# EAGLE design Grove_RTD_Sensor (EAGLE 6.5.0)
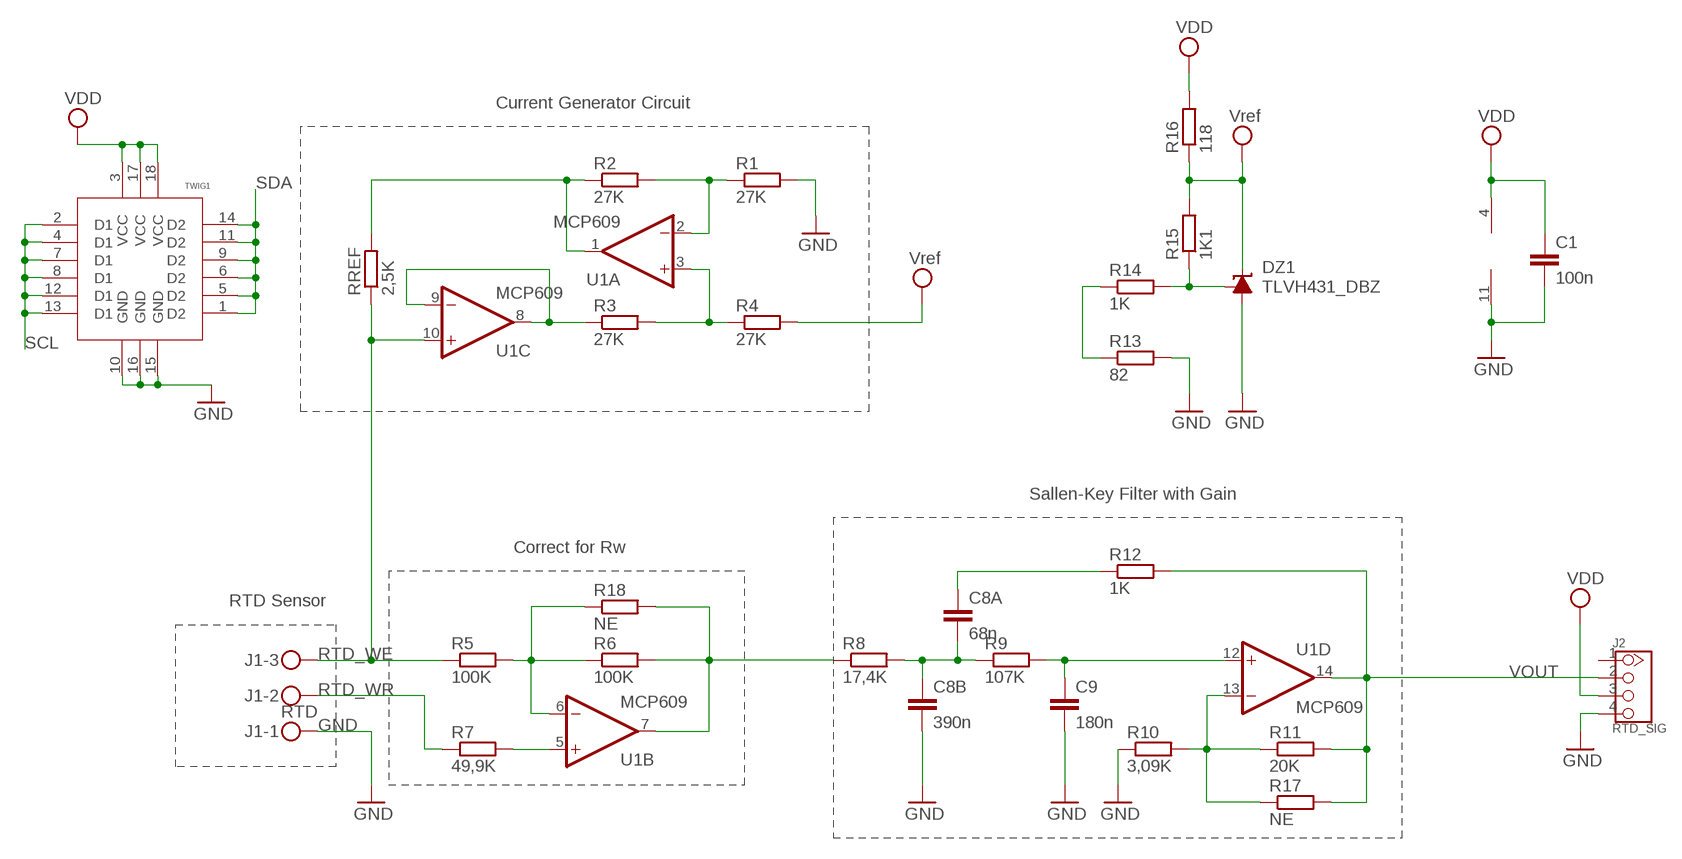
[diagram p0: schematic, sheet 1]

## Parts
C1  100n  C-EUC0805  [C0805]
C8A  68n  C-EUC0805  [C0805]
C8B  390n  C-EUC0805  [C0805]
C9  180n  C-EUC0805  [C0805]
DZ1  TLVH431_DBZ  [SOT23]
J1  RTD  MKDSN1,5/3-5,08  [MKDSN1,5/3-5,08]
J2  RTD_SIG  TWIG_2.0-DIP-FEMALE  [2.0_1X4]
R1  27K  R-EU_R0805  [R0805]
R2  27K  R-EU_R0805  [R0805]
R3  27K  R-EU_R0805  [R0805]
R4  27K  R-EU_R0805  [R0805]
R5  100K  R-EU_R0805  [R0805]
R6  100K  R-EU_R0805  [R0805]
R7  49,9K  R-EU_R0805  [R0805]
R8  17,4K  R-EU_R0805  [R0805]
R9  107K  R-EU_R0805  [R0805]
R10  3,09K  R-EU_R0805  [R0805]
R11  20K  R-EU_R0805  [R0805]
R12  1K  R-EU_R0805  [R0805]
R13  82  R-EU_R0805  [R0805]
R14  1K  R-EU_R0805  [R0805]
R15  1K1  R-EU_R0805  [R0805]
R16  118  R-EU_R0805  [R0805]
R17  NE  R-EU_R0805  [R0805]
R18  NE  R-EU_R0805  [R0805]
RREF  2,5K  R-EU_R0805  [R0805]
TWIG1  TWIG-U2'HOLES'  [U2_HOLES]
U1  MCP609  [SO14]

## Nets
GND: C1.2 C8B.2 C9.2 DZ1.3(A) J1.1 J2.4 R1.2 R10.1 R13.2 TWIG1.10(GND) TWIG1.15(GND) TWIG1.16(GND) U1.11(P:V-)
N$1: R1.1 R2.2 U1.2(A:-IN)
N$2: R3.2 R4.1 U1.3(A:+IN)
N$3: R2.1 RREF.2 U1.1(A:OUT)
N$4: R3.1 U1.8(C:OUT) U1.9(C:-IN)
N$5: DZ1.1(FB) R14.2 R15.1
N$6: R6.2 R8.1 R18.2 U1.7(B:OUT)
N$7: R7.2 U1.5(B:+IN)
N$8: R5.2 R6.1 R18.1 U1.6(B:-IN)
N$9: R13.1 R14.1
N$10: C9.1 R9.2 U1.12(D:+IN)
N$11: C8A.2 C8B.1 R8.2 R9.1
N$13: R10.2 R11.1 R17.1 U1.13(D:-IN)
N$15: C8A.1 R12.1
RTD_WE: J1.3 R5.1 RREF.1 U1.10(C:+IN)
RTD_WR: J1.2 R7.1
SCL: TWIG1.2(D1) TWIG1.4(D1) TWIG1.7(D1) TWIG1.8(D1) TWIG1.12(D1) TWIG1.13(D1)
SDA: TWIG1.1(D2) TWIG1.5(D2) TWIG1.6(D2) TWIG1.9(D2) TWIG1.11(D2) TWIG1.14(D2)
VDD: C1.1 J2.3 R16.2 TWIG1.3(VCC) TWIG1.17(VCC) TWIG1.18(VCC) U1.4(P:V+)
VEE: DZ1.2(C) R4.2 R15.2 R16.1 ; supply symbol labelled Vref
VOUT: J2.2 R11.2 R12.2 R17.2 U1.14(D:OUT)
Unconnected: J2.1

## Notes on the sheet
- Current Generator Circuit
- Sallen-Key Filter with Gain
- Correct for Rw
- RTD Sensor

## Library data of the parts
C1 C8A C8B C9 = rcl:C-EU: CAPACITOR, European symbol
DZ1 = PRECISION VOLTAGE REFERENCE:TLVH431_: TEXAS Instruments TLVH431 LOW-VOLTAGE ADJUSTABLE PRECISION SHUNT REGULATOR Features: low-voltage operation ... down to 1.24V reference voltage tolerances at 25°C - 0.5% for B grade - 1% for A grade - 1.5% for standard grade adjustable output voltage, Vo = Vref to 18V wide operating cathode current range ... 55 µA to 80 mA 0.25 hom typycal output impedance -40°C to 125°C specifications TLVH432 provides alternative pinouts for SOT-23-3 and SOT-89 packages ultra-small SC-70 package offers 40% smaller footprint than SOT-23-3
J1 = con-phoenix-508:MKDSN1,5/3-5,08: MKDSN 1,5/ 3-5,08 Printklemme Nennstrom: 13,5 A Nennspannung: 250 V Rastermaß: 5,08 mm Polzahl: 3 Anschlussart: Schraubanschluss Montage: Löten Anschlussrichtung Leiter/Platine: 0 ° Artikelnummer: 1729131 Source: http://eshop.phoenixcontact.com .. 1729131.pdf
J2 = Connector:TWIG_2.0-DIP-FEMALE
R1-R18 RREF = rcl:R-EU_: RESISTOR, European symbol
TWIG1 = EXT_moudle:TWIG-U2
U1 = MICROCHIP:MCP609: Quad Op Amp 2.5V to 5.5V Single Supply CMOS

## Board
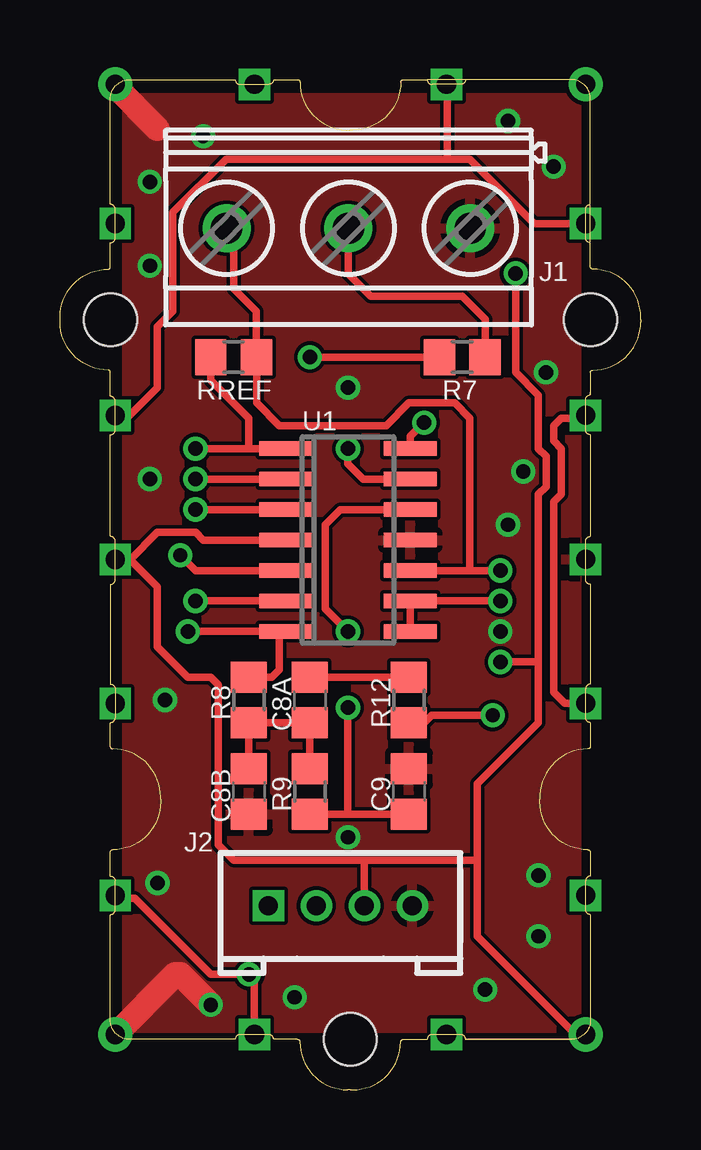
[diagram p1: board, top side]
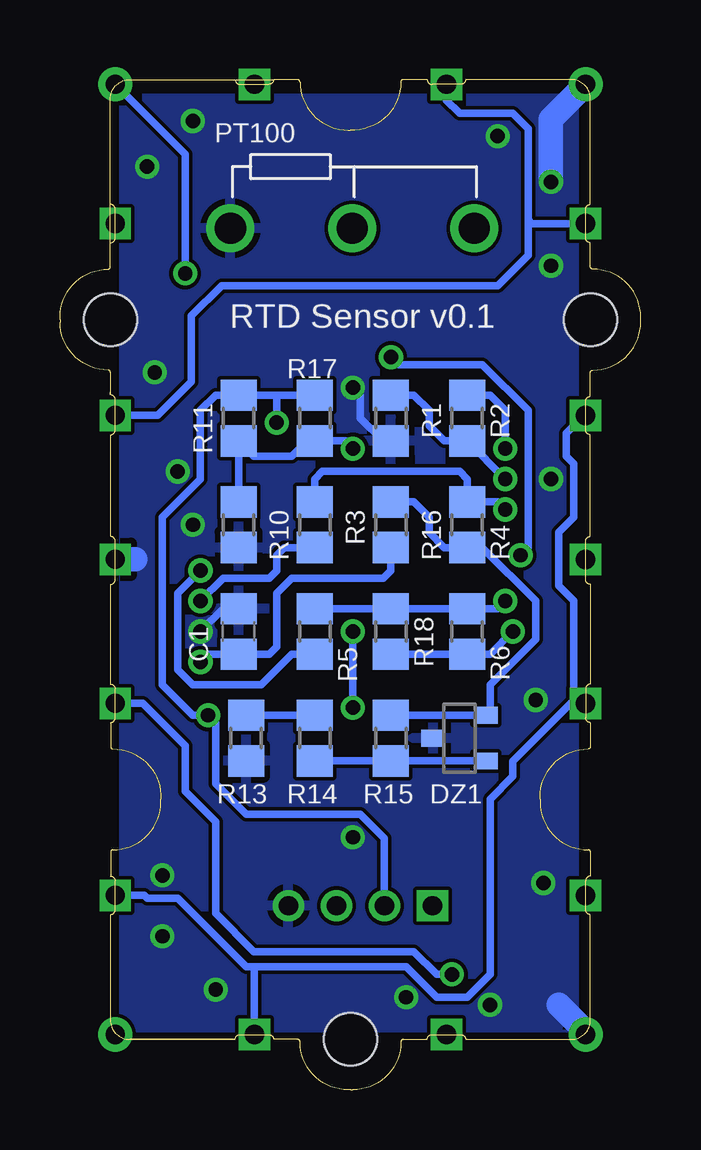
[diagram p2: board, bottom side, seen from below]

Size 24.2 x 42.09 mm. Coordinates in mm from the lower left corner, seen from the top.
Copper layers (1*16): Top 0.035mm / dielectric 1.5mm / Bottom 0.035mm
Design rules "seeedstudio *": minimum track width 6mil, minimum drill 12mil, track to track 6mil, track to pad 6mil, pad to pad 6mil, via to via 6mil, smd to smd 6mil, copper to edge 0mil, drill to drill 8mil, minimum pad ring 10mil, minimum via ring 8mil, stop-mask expansion 4mil, vias tented up to drill 0mil, thermal gap 10mil

### Footprints (pad centres in the part's own frame; a part is rotated, then mirrored left to right if it is on the bottom)
C0805 = smd 1.3 x 1.5: 1 -0.95,0; 2 0.95,0
SOT23 = smd 0.7 x 1: 1 -0.95,-1.1; 2 0.95,-1.1; 3 0,1.1
MKDSN1,5/3-5,08 = drill 1.3 pad 2: 1 -7.641,0.025; 2 -2.561,0.025; 3 2.519,0.025
2.0_1X4 = drill 0.8 pad 1.27 square: 1 -3,0 | drill 0.8 pad 1.27: 2 -1,0; 3 1,0; 4 3,0
R0805 = smd 1.3 x 1.5: 1 -0.95,0; 2 0.95,0
U2_HOLES = drill 0.8 pad 1.27 square: 1 -13.545,9.38; 2 -5.545,9.38; 3 0.455,9.38; 4 6.455,9.38; 5 14.455,9.38; 6 20.255,3.58; 7 20.255,-4.42; 8 14.455,-10.22; 9 6.465,-10.22; 10 0.465,-10.22; 11 -5.535,-10.22; 12 -13.535,-10.22; 13 -19.335,-4.42; 14 -19.335,3.58 | drill 0.8 pad 1.422: 15 -19.335,9.38; 16 20.255,9.38; 17 20.255,-10.22; 18 -19.335,-10.22 | hole 2.2: 10.453,-10.42; 10.453,9.58; -19.535,-0.415
SO14 = smd 0.6 x 2.2: 1 -3.81,-2.6; 2 -2.54,-2.6; 3 -1.27,-2.6; 4 0,-2.6; 5 1.27,-2.6; 6 2.54,-2.6; 7 3.81,-2.6; 8 3.81,2.6; 9 2.54,2.6; 10 1.27,2.6; 11 0,2.6; 12 -1.27,2.6; 13 -2.54,2.6; 14 -3.81,2.6

### Placement (x,y rotation side)
C1  16.76,19.09 90 bottom
C8A  10.41,16.24 270 top
C8B  7.87,12.43 270 top
C9  14.54,12.43 90 top
DZ1  7.55,14.65 90 bottom
J1  9.46,35.92 180 top
J2  11.68,7.67 0 top
R1  10.41,27.98 270 bottom
R2  7.23,27.98 270 bottom
R3  13.58,23.54 90 bottom
R4  7.23,23.54 270 bottom
R5  13.58,19.09 90 bottom
R6  7.23,19.09 270 bottom
R7  16.76,30.52 180 top
R8  7.87,16.24 270 top
R9  10.41,12.43 270 top
R10  16.76,23.54 90 bottom
R11  16.76,27.98 90 bottom
R12  14.54,16.24 270 top
R13  16.44,14.65 270 bottom
R14  13.58,14.65 270 bottom
R15  10.41,14.65 90 bottom
R16  10.41,23.54 270 bottom
R17  13.58,27.98 90 bottom
R18  10.41,19.09 270 bottom
RREF  7.23,30.52 180 top
TWIG1  11.68,21.64 90 top
U1  12,22.91 270 top

### Tracks (layer width: path | path; a pad name or v marks a point on that pad's centre or on a via)
GND  (via drill 0.6)
  Top 1.016: TWIG1.16 2.3,41.81 4.06,40.05 | v6.28,3.54 5.01,4.81 4.81,4.81 TWIG1.15
  Bottom 0.305: R1.2 10.73,27.03 11.68,27.98 11.68,28.94 v12,29.25 | v18.35,19.09 17.39,20.05 C1.2 | R10.1
  Bottom 1.016: 21.06,22.1 TWIG1.10 | TWIG1.15 2.3,2.41 3.42,3.54 | v3.74,37.83 3.74,40.45 TWIG1.16
  other vias: 5.96,39.73 19.93,6.4 17.71,4.17 18.66,23.54 18.66,40.37 20.57,38.46 19.93,8.94 4.06,8.62 4.38,16.24 3.74,34.34 20.25,29.89 12,10.52 9.78,3.86 3.74,25.45 19.3,25.76
  pour Bottom: 2.79,2.59 21.52,2.59 21.52,41.32 2.79,41.32
  pour Top: 2.79,2.59 21.52,2.59 21.52,41.32 2.79,41.32
N$1  (via drill 0.6)
  Top 0.305: v5.65,25.44 U1.2
  Bottom 0.305: v5.65,25.44 v5.65,25.45 R2.2 8.19,27.03 8.82,27.67 8.82,28.3 9.45,28.93 R1.1
N$2  (via drill 0.6)
  Top 0.305: v5.65,24.18 U1.3
  Bottom 0.305: v5.65,24.18 5.97,24.49 R4.1 7.23,25.44 7.55,25.76 13.27,25.76 13.58,25.44 R3.2
N$3  (via drill 0.6)
  Top 0.305: v5.65,26.71 7.87,26.71 | 7.87,26.71 U1.1 | RREF.2 6.28,29.57 7.87,27.98 7.87,26.71
  Bottom 0.305: R2.1 6.28,28.93 5.65,28.3 v5.65,26.71
N$4  (via drill 0.6)
  Top 0.305: U1.8 U1.9 v18.35,20.37
  Bottom 0.305: v18.35,20.37 17.39,21.32 15.49,21.32 15.17,21.64 15.17,22.27 14.86,22.59 R3.1
N$5
  Bottom 0.305: DZ1.1 R15.1 R14.2
N$6  (via drill 0.6)
  Top 0.305: v5.33,19.09 U1.7 9.14,18.84 9.14,17.51 8.82,17.19 R8.1
  Bottom 0.305: R18.2 R6.2 6.28,18.14 v5.33,19.09
N$7  (via drill 0.6)
  Top 0.305: v10.41,30.52 R7.2 | v5.01,22.27 5.65,21.64 U1.5
  Bottom 0.305: v10.41,30.52 10.09,30.21 6.6,30.21 4.69,28.3 4.69,22.59 v5.01,22.27
N$8  (via drill 0.6)
  Top 0.305: v5.65,20.37 U1.6
  Bottom 0.305: v5.65,20.37 5.97,20.05 R6.1 R18.1 R5.2
N$9
  Bottom 0.305: R14.1 R13.1
N$10  (via drill 0.6)
  Top 0.305: R9.2 12,11.47 | 12,11.47 13.9,11.47 C9.1 | U1.12 11.68,24.18 11.04,23.54 11.04,20.05 v12,19.09 | 12,11.47 v12,15.92
  Bottom 0.305: v12,15.92 v12,19.09
N$11
  Top 0.305: C8B.1 R8.2 C8A.2 R9.1
N$13  (via drill 0.6)
  Top 0.305: U1.13 12.63,25.44 12,26.08 v12,26.71
  Bottom 0.305: R10.2 R11.1 16.12,26.4 14.54,26.4 13.9,27.03 R17.1 12.31,27.03 v12,26.71
N$15
  Top 0.305: C8A.1 R12.1
RTD_WE  (via drill 0.6)
  Top 0.305: 17.08,21.64 U1.10 | v18.35,21.64 17.08,21.64 | J1.3 7.23,35.6 7.23,33.38 8.18,32.43 RREF.1 8.19,28.62 9.14,27.67 13.58,27.67 14.54,28.62 16.44,28.62 17.08,27.98 17.08,21.64
  Bottom 0.305: R5.1 14.54,18.14 15.81,16.87 18.66,16.87 19.3,17.51 19.3,20.68 v18.35,21.64
RTD_WR
  Top 0.305: J1.2 12.02,34 12.95,33.07 16.76,33.07 17.71,32.11 R7.1
SCL
  Top 0.305: TWIG1.8 19.77,36.09 17.08,38.78 16.12,38.78 | TWIG1.7 16.12,41.87 16.12,38.78 | TWIG1.4 2.89,28.09 4.06,29.25 4.06,31.8 4.69,32.43 4.69,36.56 6.92,38.78 16.12,38.78
  Bottom 0.305: 16.12,5.13 9.78,5.13 8.5,3.86 7.23,3.86 6.28,4.81 6.28,12.11 5.33,13.06 5.33,13.7 2.94,16.09 | 16.12,5.13 16.44,5.13 19.3,7.98 20.57,7.98 20.69,8.1 TWIG1.12 | 2.94,16.09 TWIG1.2 | TWIG1.13 16.1,5.1 16.12,5.13 | TWIG1.4 2.37,28.09 3.11,27.35 3.11,26.4 2.79,26.08 2.79,23.86 3.42,23.22 3.42,21 2.79,20.37 2.79,16.24 2.94,16.09
SDA  (via drill 0.6)
  Top 0.305: TWIG1.14 8.1,4.58 v7.87,4.81 6.28,4.81 3.11,7.98 2.41,7.98 TWIG1.1 | TWIG1.11 21.02,16.1 20.57,16.55 20.57,24.49 20.89,24.81 20.89,26.71 20.57,27.03 20.57,27.67 20.89,27.98 21.79,27.98 TWIG1.9
  Bottom 0.305: TWIG1.11 20.75,16.1 18.98,14.33 18.98,12.43 17.71,11.16 17.71,7.35 16.12,5.76 9.46,5.76 8.5,4.81 v7.87,4.81 | TWIG1.9 20.14,28.1 18.73,29.51 18.73,32.24 17.46,33.51 5.96,33.51 4.69,34.78 4.69,36.24 | TWIG1.6 8.1,41.23 7.55,40.69 5.33,40.69 4.69,40.05 4.69,36.24 | TWIG1.5 4.54,36.09 4.69,36.24
VDD  (via drill 0.6)
  Top 0.305: 2.93,22.09 TWIG1.3 | 2.93,22.09 4.06,23.22 5.65,23.22 5.96,22.91 U1.4 | 2.93,22.09 4.06,20.96 4.06,18.46 5.33,17.19 6.28,17.19 6.6,16.87 6.6,10.2 7.23,9.57 12.63,9.57 | 19.93,17.82 v18.35,17.82 | 12.63,9.57 17.39,9.57 | TWIG1.18 21.49,2.3 17.39,6.4 17.39,9.57 | J2.3 12.68,9.52 12.63,9.57 | 17.39,9.57 17.39,12.75 19.93,15.28 19.93,17.82 | v18.98,34.02 18.98,29.89 19.93,28.94 19.93,26.71 20.25,26.4 20.25,25.13 19.93,24.81 19.93,17.82
  Bottom 0.305: R16.2 10.41,21.64 10.73,21.32 14.54,21.32 15.17,20.68 15.17,18.46 15.49,18.14 C1.1 18.03,18.14 v18.35,17.82 | v18.98,34.02 18.98,38.97 TWIG1.17
VEE
  Bottom 0.305: R15.2 DZ1.2 6.28,15.77 6.28,16.87 4.38,18.78 4.38,20.37 6.6,22.59 R4.2 | R16.1 9.46,24.49 8.82,23.86 8.82,23.22 8.19,22.59 R4.2 | R4.2
VOUT  (via drill 0.6)
  Top 0.305: R12.2 15.17,15.28 15.49,15.6 v18.03,15.6 | U1.14 14.6,27.22 v15.17,27.79
  Bottom 0.305: R11.2 R17.2 | J2.2 10.68,10.47 11.68,11.47 16.44,11.47 17.71,12.75 17.71,15.28 v18.03,15.6 18.66,15.6 19.93,16.87 19.93,23.86 18.35,25.44 18.35,28.3 17.71,28.93 R11.2 | v15.17,27.79 15.17,28.94 R11.2

### Text on the board
bNames: PT100 | RTD Sensor v0.1